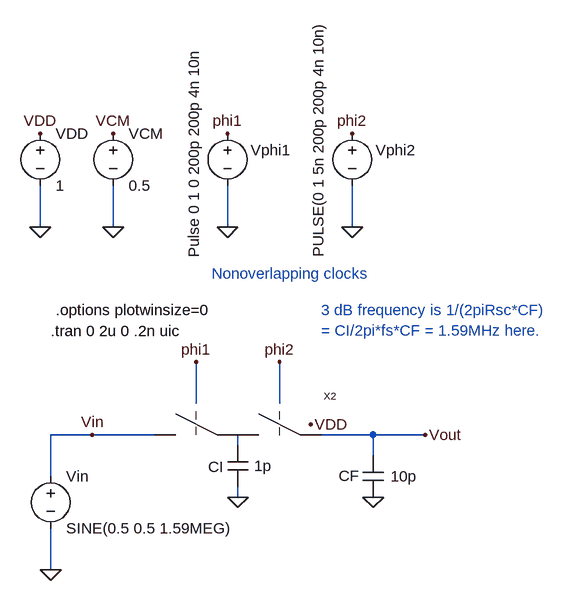
[diagram p0: schematic _Fig2_35_MSD.asc]
_Fig2_35_MSD.asc, the LTspice schematic file:
Version 4
SHEET 1 2740 696
WIRE 592 -704 592 -768
WIRE 704 -704 704 -768
WIRE 880 -704 880 -768
WIRE 1072 -704 1072 -768
WIRE 832 -432 832 -496
WIRE 960 -432 960 -496
WIRE 672 -384 608 -384
WIRE 768 -384 672 -384
WIRE 1104 -384 1024 -384
WIRE 1184 -384 1104 -384
WIRE 896 -368 896 -384
WIRE 1104 -352 1104 -384
WIRE 608 -320 608 -384
WIRE 896 -288 896 -304
WIRE 608 -176 608 -240
FLAG 608 -176 0
FLAG 672 -384 Vin
FLAG 880 -704 0
FLAG 880 -848 phi1
FLAG 592 -704 0
FLAG 592 -848 VDD
FLAG 1008 -400 VDD
FLAG 832 -496 phi1
FLAG 960 -496 phi2
FLAG 1072 -704 0
FLAG 1072 -848 phi2
FLAG 704 -704 0
FLAG 704 -848 VCM
FLAG 896 -288 0
FLAG 1104 -288 0
FLAG 1184 -384 Vout
SYMBOL voltage 608 -336 R0
WINDOW 123 0 0 Left 0
WINDOW 39 0 0 Left 0
SYMATTR InstName Vin
SYMATTR Value SINE(0.5 0.5 1.59MEG)
SYMBOL voltage 880 -864 R0
WINDOW 0 36 42 Left 0
WINDOW 3 -52 207 VLeft 0
WINDOW 123 0 0 Left 0
WINDOW 39 0 0 Left 0
SYMATTR InstName Vphi1
SYMATTR Value Pulse 0 1 0 200p 200p 4n 10n
SYMBOL voltage 592 -864 R0
WINDOW 123 0 0 Left 0
WINDOW 39 0 0 Left 0
SYMATTR InstName VDD
SYMATTR Value 1
SYMBOL switches_2 768 -368 R0
SYMATTR InstName X2
SYMBOL cap 880 -368 R0
WINDOW 0 -30 33 Left 0
WINDOW 3 41 32 Left 0
SYMATTR InstName CI
SYMATTR Value 1p
SYMBOL voltage 1072 -864 R0
WINDOW 0 36 42 Left 0
WINDOW 3 -52 207 VLeft 0
WINDOW 123 0 0 Left 0
WINDOW 39 0 0 Left 0
SYMATTR InstName Vphi2
SYMATTR Value PULSE(0 1 5n 200p 200p 4n 10n)
SYMBOL voltage 704 -864 R0
WINDOW 123 0 0 Left 0
WINDOW 39 0 0 Left 0
SYMATTR InstName VCM
SYMATTR Value 0.5
SYMBOL cap 1088 -352 R0
WINDOW 0 -37 31 Left 0
WINDOW 3 43 32 Left 0
SYMATTR InstName CF
SYMATTR Value 10p
TEXT 608 -544 Left 0 !.tran 0 2u 0 .2n uic
TEXT 856 -632 Left 0 ;Nonoverlapping clocks
TEXT 616 -576 Left 0 !.options plotwinsize=0
TEXT 1024 -576 Left 0 ;3 dB frequency is 1/(2piRsc*CF)\n= CI/2pi*fs*CF = 1.59MHz here.

The netlist it stands for:
* _Fig2_35_MSD.asc
Vin Vin 0 SINE(0.5 0.5 1.59MEG)
Vphi1 phi1 0 Pulse 0 1 0 200p 200p 4n 10n
VDD VDD 0 1
XX2 Vin phi1 phi2 Vout VDD N001 switches_2  ; pins P1 clk1 Clk2 P3 VDD P2
CI N001 0 1p
Vphi2 phi2 0 PULSE(0 1 5n 200p 200p 4n 10n)
VCM VCM 0 0.5
CF Vout 0 10p
.tran 0 2u 0 .2n uic
* Nonoverlapping clocks
.options plotwinsize=0
* 3 dB frequency is 1/(2piRsc*CF)
* = CI/2pi*fs*CF = 1.59MHz here.
.backanno
.end